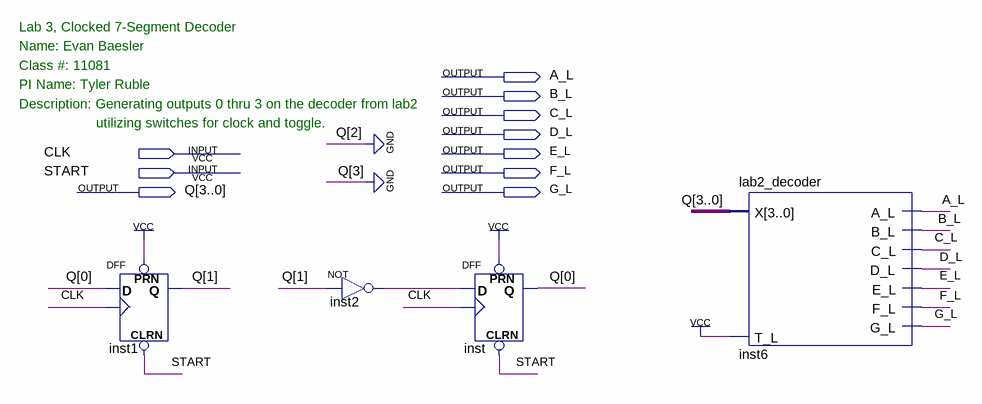
[diagram p0: schematic sheet]
// Quartus schematic lab3_2bit_cnt.bdf as structural Verilog: 4 symbols, 10 pins
module lab3_2bit_cnt (
  input  CLK,
  input  START,
  output A_L,
  output B_L,
  output C_L,
  output D_L,
  output E_L,
  output F_L,
  output [3:0] Q,
  output G_L
);

  wire inst2_out;

  DFF inst1 (.CLRN(START), .CLK(CLK), .D(Q[0]), .PRN(1'b1), .Q(Q[1]));
  not inst2 (inst2_out, Q[1]);
  DFF inst (.CLRN(START), .CLK(CLK), .D(inst2_out), .PRN(1'b1), .Q(Q[0]));
  lab2_decoder inst6 (
    .X({2'b00, Q[1:0]}), .T_L(1'b1), .C_L(C_L), .D_L(D_L), .A_L(A_L), .E_L(E_L), .B_L(B_L), .F_L(F_L),
    .G_L(G_L));

  assign Q[3:2] = 2'b00;

  // Notes on the sheet:
  //   Lab 3, Clocked 7-Segment Decoder
  //   Name: Evan Baesler
  //   Class #: 11081
  //   PI Name: Tyler Ruble
  //   Description: Generating outputs 0 thru 3 on the decoder from lab2
  //   utilizing switches for clock and toggle.
endmodule
